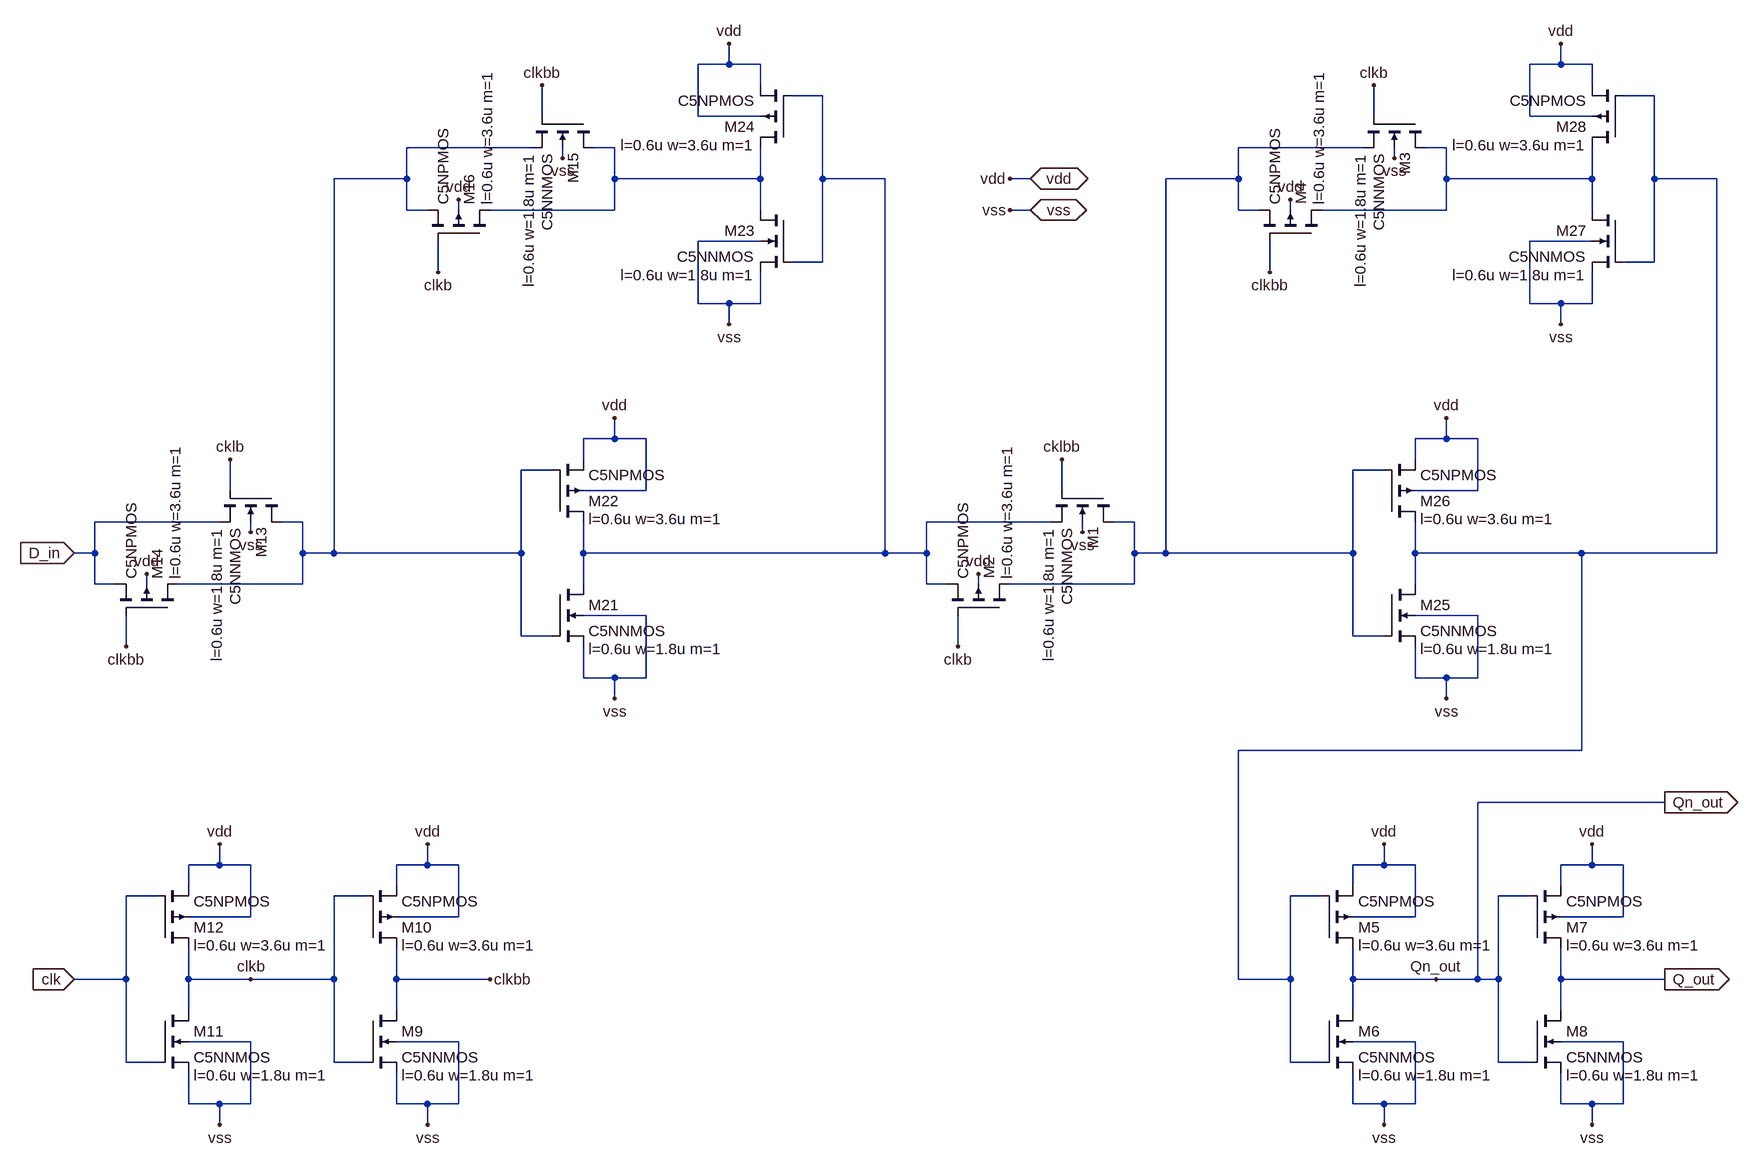
[diagram p0: schematic D_Flip_Flop.asc]
D_Flip_Flop.asc, the LTspice schematic file:
Version 4
SHEET 1 2356 1796
WIRE 432 -816 432 -848
WIRE 432 -816 384 -816
WIRE 480 -816 432 -816
WIRE 1712 -816 1712 -848
WIRE 1712 -816 1664 -816
WIRE 1760 -816 1712 -816
WIRE 480 -784 480 -816
WIRE 1760 -784 1760 -816
WIRE 576 -768 528 -768
WIRE 1856 -768 1808 -768
WIRE 144 -736 144 -784
WIRE 384 -736 384 -816
WIRE 480 -736 384 -736
WIRE 1424 -736 1424 -784
WIRE 1664 -736 1664 -816
WIRE 1760 -736 1664 -736
WIRE 128 -688 -64 -688
WIRE 256 -688 224 -688
WIRE 1408 -688 1216 -688
WIRE 1536 -688 1504 -688
WIRE 176 -672 176 -688
WIRE 1456 -672 1456 -688
WIRE -64 -640 -64 -688
WIRE -64 -640 -176 -640
WIRE 256 -640 256 -688
WIRE 480 -640 480 -688
WIRE 480 -640 256 -640
WIRE 576 -640 576 -768
WIRE 672 -640 576 -640
WIRE 896 -640 864 -640
WIRE 1216 -640 1216 -688
WIRE 1216 -640 1104 -640
WIRE 1536 -640 1536 -688
WIRE 1760 -640 1760 -688
WIRE 1760 -640 1536 -640
WIRE 1856 -640 1856 -768
WIRE 1952 -640 1856 -640
WIRE -64 -592 -64 -640
WIRE -32 -592 -64 -592
WIRE 16 -592 16 -608
WIRE 256 -592 256 -640
WIRE 256 -592 64 -592
WIRE 480 -592 480 -640
WIRE 896 -592 864 -592
WIRE 1216 -592 1216 -640
WIRE 1248 -592 1216 -592
WIRE 1296 -592 1296 -608
WIRE 1536 -592 1536 -640
WIRE 1536 -592 1344 -592
WIRE 1760 -592 1760 -640
WIRE 480 -544 384 -544
WIRE 1760 -544 1664 -544
WIRE 576 -512 576 -640
WIRE 576 -512 528 -512
WIRE 1856 -512 1856 -640
WIRE 1856 -512 1808 -512
WIRE -16 -496 -16 -544
WIRE 1264 -496 1264 -544
WIRE 384 -448 384 -544
WIRE 432 -448 384 -448
WIRE 480 -448 480 -496
WIRE 480 -448 432 -448
WIRE 1664 -448 1664 -544
WIRE 1712 -448 1664 -448
WIRE 1760 -448 1760 -496
WIRE 1760 -448 1712 -448
WIRE 432 -416 432 -448
WIRE 1712 -416 1712 -448
WIRE 256 -240 256 -272
WIRE 256 -240 208 -240
WIRE 304 -240 256 -240
WIRE 1536 -240 1536 -272
WIRE 1536 -240 1488 -240
WIRE 1584 -240 1536 -240
WIRE 208 -208 208 -240
WIRE 1488 -208 1488 -240
WIRE 160 -192 112 -192
WIRE 1440 -192 1392 -192
WIRE -336 -160 -336 -208
WIRE 304 -160 304 -240
WIRE 304 -160 208 -160
WIRE 944 -160 944 -208
WIRE 1584 -160 1584 -240
WIRE 1584 -160 1488 -160
WIRE -352 -112 -544 -112
WIRE -224 -112 -256 -112
WIRE 928 -112 736 -112
WIRE 1056 -112 1024 -112
WIRE -304 -96 -304 -112
WIRE 976 -96 976 -112
WIRE -544 -64 -544 -112
WIRE -544 -64 -576 -64
WIRE -224 -64 -224 -112
WIRE -176 -64 -176 -640
WIRE -176 -64 -224 -64
WIRE 112 -64 112 -192
WIRE 112 -64 -176 -64
WIRE 208 -64 208 -112
WIRE 672 -64 672 -640
WIRE 672 -64 208 -64
WIRE 736 -64 736 -112
WIRE 736 -64 672 -64
WIRE 1056 -64 1056 -112
WIRE 1104 -64 1104 -640
WIRE 1104 -64 1056 -64
WIRE 1392 -64 1392 -192
WIRE 1392 -64 1104 -64
WIRE 1488 -64 1488 -112
WIRE 1744 -64 1488 -64
WIRE 1952 -64 1952 -640
WIRE 1952 -64 1744 -64
WIRE -544 -16 -544 -64
WIRE -512 -16 -544 -16
WIRE -464 -16 -464 -32
WIRE -224 -16 -224 -64
WIRE -224 -16 -416 -16
WIRE 208 -16 208 -64
WIRE 736 -16 736 -64
WIRE 768 -16 736 -16
WIRE 816 -16 816 -32
WIRE 1056 -16 1056 -64
WIRE 1056 -16 864 -16
WIRE 1488 -16 1488 -64
WIRE 304 32 208 32
WIRE 1584 32 1488 32
WIRE 112 64 112 -64
WIRE 160 64 112 64
WIRE 1392 64 1392 -64
WIRE 1440 64 1392 64
WIRE -496 80 -496 32
WIRE 784 80 784 32
WIRE 208 128 208 80
WIRE 256 128 208 128
WIRE 304 128 304 32
WIRE 304 128 256 128
WIRE 1488 128 1488 80
WIRE 1536 128 1488 128
WIRE 1584 128 1584 32
WIRE 1584 128 1536 128
WIRE 256 160 256 128
WIRE 1536 160 1536 128
WIRE 1744 240 1744 -64
WIRE 1744 240 1216 240
WIRE 1872 320 1584 320
WIRE -352 416 -352 384
WIRE -352 416 -400 416
WIRE -304 416 -352 416
WIRE -32 416 -32 384
WIRE -32 416 -80 416
WIRE 16 416 -32 416
WIRE 1440 416 1440 384
WIRE 1440 416 1392 416
WIRE 1488 416 1440 416
WIRE 1760 416 1760 384
WIRE 1760 416 1712 416
WIRE 1808 416 1760 416
WIRE -400 448 -400 416
WIRE -80 448 -80 416
WIRE 1392 448 1392 416
WIRE 1712 448 1712 416
WIRE -448 464 -496 464
WIRE -128 464 -176 464
WIRE 1344 464 1296 464
WIRE 1664 464 1616 464
WIRE -304 496 -304 416
WIRE -304 496 -400 496
WIRE 16 496 16 416
WIRE 16 496 -80 496
WIRE 1488 496 1488 416
WIRE 1488 496 1392 496
WIRE 1808 496 1808 416
WIRE 1808 496 1712 496
WIRE -496 592 -496 464
WIRE -496 592 -576 592
WIRE -400 592 -400 544
WIRE -304 592 -400 592
WIRE -176 592 -176 464
WIRE -176 592 -304 592
WIRE -80 592 -80 544
WIRE 64 592 -80 592
WIRE 1216 592 1216 240
WIRE 1296 592 1296 464
WIRE 1296 592 1216 592
WIRE 1392 592 1392 544
WIRE 1520 592 1392 592
WIRE 1584 592 1584 320
WIRE 1584 592 1520 592
WIRE 1616 592 1616 464
WIRE 1616 592 1584 592
WIRE 1712 592 1712 544
WIRE 1872 592 1712 592
WIRE -400 640 -400 592
WIRE -80 640 -80 592
WIRE 1392 640 1392 592
WIRE 1712 640 1712 592
WIRE -304 688 -400 688
WIRE 16 688 -80 688
WIRE 1488 688 1392 688
WIRE 1808 688 1712 688
WIRE -496 720 -496 592
WIRE -448 720 -496 720
WIRE -176 720 -176 592
WIRE -128 720 -176 720
WIRE 1296 720 1296 592
WIRE 1344 720 1296 720
WIRE 1616 720 1616 592
WIRE 1664 720 1616 720
WIRE -400 784 -400 736
WIRE -352 784 -400 784
WIRE -304 784 -304 688
WIRE -304 784 -352 784
WIRE -80 784 -80 736
WIRE -32 784 -80 784
WIRE 16 784 16 688
WIRE 16 784 -32 784
WIRE 1392 784 1392 736
WIRE 1440 784 1392 784
WIRE 1488 784 1488 688
WIRE 1488 784 1440 784
WIRE 1712 784 1712 736
WIRE 1760 784 1712 784
WIRE 1808 784 1808 688
WIRE 1808 784 1760 784
WIRE -352 816 -352 784
WIRE -32 816 -32 784
WIRE 1440 816 1440 784
WIRE 1760 816 1760 784
FLAG 1872 592 Q_out
IOPIN 1872 592 Out
FLAG 896 -592 vss
IOPIN 896 -592 BiDir
FLAG 896 -640 vdd
IOPIN 896 -640 BiDir
FLAG 1440 384 vdd
FLAG 1760 384 vdd
FLAG 1440 816 vss
FLAG 1760 816 vss
FLAG 864 -640 vdd
FLAG 864 -592 vss
FLAG -352 384 vdd
FLAG -32 384 vdd
FLAG -352 816 vss
FLAG -32 816 vss
FLAG -576 592 clk
IOPIN -576 592 In
FLAG -304 592 clkb
FLAG 64 592 clkbb
FLAG -336 -208 cklb
FLAG -496 80 clkbb
FLAG -16 -496 clkb
FLAG 144 -784 clkbb
FLAG -304 -96 vss
FLAG -464 -32 vdd
FLAG 16 -608 vdd
FLAG 176 -672 vss
FLAG 432 -848 vdd
FLAG 256 -272 vdd
FLAG 432 -416 vss
FLAG 256 160 vss
FLAG 1520 592 Qn_out
FLAG 1872 320 Qn_out
IOPIN 1872 320 Out
FLAG -576 -64 D_in
IOPIN -576 -64 In
FLAG 944 -208 cklbb
FLAG 784 80 clkb
FLAG 1264 -496 clkbb
FLAG 1424 -784 clkb
FLAG 976 -96 vss
FLAG 816 -32 vdd
FLAG 1296 -608 vdd
FLAG 1456 -672 vss
FLAG 1712 -848 vdd
FLAG 1536 -272 vdd
FLAG 1712 -416 vss
FLAG 1536 160 vss
SYMBOL nmos4 1664 640 R0
WINDOW 123 56 100 Left 2
SYMATTR Value2 l=0.6u w=1.8u m=1
SYMATTR InstName M8
SYMATTR Value C5NNMOS
SYMBOL pmos4 1664 544 M180
WINDOW 123 56 4 Left 2
SYMATTR Value2 l=0.6u w=3.6u m=1
SYMATTR InstName M7
SYMATTR Value C5NPMOS
SYMBOL nmos4 1344 640 R0
WINDOW 123 56 100 Left 2
SYMATTR Value2 l=0.6u w=1.8u m=1
SYMATTR InstName M6
SYMATTR Value C5NNMOS
SYMBOL pmos4 1344 544 M180
WINDOW 123 56 4 Left 2
SYMATTR Value2 l=0.6u w=3.6u m=1
SYMATTR InstName M5
SYMATTR Value C5NPMOS
SYMBOL nmos4 -128 640 R0
WINDOW 123 56 100 Left 2
SYMATTR Value2 l=0.6u w=1.8u m=1
SYMATTR InstName M9
SYMATTR Value C5NNMOS
SYMBOL pmos4 -128 544 M180
WINDOW 123 56 4 Left 2
SYMATTR Value2 l=0.6u w=3.6u m=1
SYMATTR InstName M10
SYMATTR Value C5NPMOS
SYMBOL nmos4 -448 640 R0
WINDOW 123 56 100 Left 2
SYMATTR Value2 l=0.6u w=1.8u m=1
SYMATTR InstName M11
SYMATTR Value C5NNMOS
SYMBOL pmos4 -448 544 M180
WINDOW 123 56 4 Left 2
SYMATTR Value2 l=0.6u w=3.6u m=1
SYMATTR InstName M12
SYMATTR Value C5NPMOS
SYMBOL nmos4 -256 -160 R90
WINDOW 123 56 100 Left 2
SYMATTR Value2 l=0.6u w=1.8u m=1
SYMATTR InstName M13
SYMATTR Value C5NNMOS
SYMBOL pmos4 -416 32 M270
WINDOW 123 56 4 Left 2
SYMATTR Value2 l=0.6u w=3.6u m=1
SYMATTR InstName M14
SYMATTR Value C5NPMOS
SYMBOL nmos4 224 -736 R90
WINDOW 123 56 100 Left 2
SYMATTR Value2 l=0.6u w=1.8u m=1
SYMATTR InstName M15
SYMATTR Value C5NNMOS
SYMBOL pmos4 64 -544 M270
WINDOW 123 56 4 Left 2
SYMATTR Value2 l=0.6u w=3.6u m=1
SYMATTR InstName M16
SYMATTR Value C5NPMOS
SYMBOL nmos4 160 -16 R0
WINDOW 123 56 100 Left 2
SYMATTR Value2 l=0.6u w=1.8u m=1
SYMATTR InstName M21
SYMATTR Value C5NNMOS
SYMBOL pmos4 160 -112 M180
WINDOW 123 56 4 Left 2
SYMATTR Value2 l=0.6u w=3.6u m=1
SYMATTR InstName M22
SYMATTR Value C5NPMOS
SYMBOL nmos4 528 -592 M0
WINDOW 123 56 100 Left 2
SYMATTR Value2 l=0.6u w=1.8u m=1
SYMATTR InstName M23
SYMATTR Value C5NNMOS
SYMBOL pmos4 528 -688 R180
WINDOW 123 56 4 Left 2
SYMATTR Value2 l=0.6u w=3.6u m=1
SYMATTR InstName M24
SYMATTR Value C5NPMOS
SYMBOL nmos4 1024 -160 R90
WINDOW 123 56 100 Left 2
SYMATTR Value2 l=0.6u w=1.8u m=1
SYMATTR InstName M1
SYMATTR Value C5NNMOS
SYMBOL pmos4 864 32 M270
WINDOW 123 56 4 Left 2
SYMATTR Value2 l=0.6u w=3.6u m=1
SYMATTR InstName M2
SYMATTR Value C5NPMOS
SYMBOL nmos4 1504 -736 R90
WINDOW 123 56 100 Left 2
SYMATTR Value2 l=0.6u w=1.8u m=1
SYMATTR InstName M3
SYMATTR Value C5NNMOS
SYMBOL pmos4 1344 -544 M270
WINDOW 123 56 4 Left 2
SYMATTR Value2 l=0.6u w=3.6u m=1
SYMATTR InstName M4
SYMATTR Value C5NPMOS
SYMBOL nmos4 1440 -16 R0
WINDOW 123 56 100 Left 2
SYMATTR Value2 l=0.6u w=1.8u m=1
SYMATTR InstName M25
SYMATTR Value C5NNMOS
SYMBOL pmos4 1440 -112 M180
WINDOW 123 56 4 Left 2
SYMATTR Value2 l=0.6u w=3.6u m=1
SYMATTR InstName M26
SYMATTR Value C5NPMOS
SYMBOL nmos4 1808 -592 M0
WINDOW 123 56 100 Left 2
SYMATTR Value2 l=0.6u w=1.8u m=1
SYMATTR InstName M27
SYMATTR Value C5NNMOS
SYMBOL pmos4 1808 -688 R180
WINDOW 123 56 4 Left 2
SYMATTR Value2 l=0.6u w=3.6u m=1
SYMATTR InstName M28
SYMATTR Value C5NPMOS

The netlist it stands for:
* D_Flip_Flop.asc
M8 Q_out Qn_out vss vss C5NNMOS l=0.6u w=1.8u m=1
M7 Q_out Qn_out vdd vdd C5NPMOS l=0.6u w=3.6u m=1
M6 Qn_out N002 vss vss C5NNMOS l=0.6u w=1.8u m=1
M5 Qn_out N002 vdd vdd C5NPMOS l=0.6u w=3.6u m=1
M9 clkbb clkb vss vss C5NNMOS l=0.6u w=1.8u m=1
M10 clkbb clkb vdd vdd C5NPMOS l=0.6u w=3.6u m=1
M11 clkb clk vss vss C5NNMOS l=0.6u w=1.8u m=1
M12 clkb clk vdd vdd C5NPMOS l=0.6u w=3.6u m=1
M13 N003 cklb D_in vss C5NNMOS l=0.6u w=1.8u m=1
M14 N003 clkbb D_in vdd C5NPMOS l=0.6u w=3.6u m=1
M15 N004 clkbb N003 vss C5NNMOS l=0.6u w=1.8u m=1
M16 N004 clkb N003 vdd C5NPMOS l=0.6u w=3.6u m=1
M21 N001 N003 vss vss C5NNMOS l=0.6u w=1.8u m=1
M22 N001 N003 vdd vdd C5NPMOS l=0.6u w=3.6u m=1
M23 N004 N001 vss vss C5NNMOS l=0.6u w=1.8u m=1
M24 N004 N001 vdd vdd C5NPMOS l=0.6u w=3.6u m=1
M1 N005 cklbb N001 vss C5NNMOS l=0.6u w=1.8u m=1
M2 N005 clkb N001 vdd C5NPMOS l=0.6u w=3.6u m=1
M3 N006 clkb N005 vss C5NNMOS l=0.6u w=1.8u m=1
M4 N006 clkbb N005 vdd C5NPMOS l=0.6u w=3.6u m=1
M25 N002 N005 vss vss C5NNMOS l=0.6u w=1.8u m=1
M26 N002 N005 vdd vdd C5NPMOS l=0.6u w=3.6u m=1
M27 N006 N002 vss vss C5NNMOS l=0.6u w=1.8u m=1
M28 N006 N002 vdd vdd C5NPMOS l=0.6u w=3.6u m=1
.model NMOS NMOS
.model PMOS PMOS
.lib standard.mos
.backanno
.end